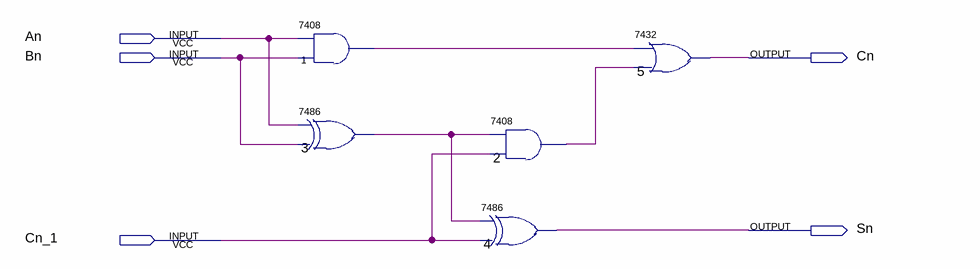
[diagram p0: schematic sheet]
// Quartus schematic Project.bdf as structural Verilog: 5 symbols, 5 pins
module Project (
  input  An,
  input  Bn,
  input  Cn_1,
  output Cn,
  output Sn
);

  wire n1_1, n2_1, n3_1;

  \7408  u_1 (.\3 (Bn), .\2 (An), .\1 (n1_1));
  \7486  u_3 (.\2 (An), .\3 (Bn), .\1 (n3_1));
  \7408  u_2 (.\3 (Cn_1), .\2 (n3_1), .\1 (n2_1));
  \7486  u_4 (.\2 (n3_1), .\3 (Cn_1), .\1 (Sn));
  \7432  u_5 (.\2 (n1_1), .\3 (n2_1), .\1 (Cn));
endmodule
